# EAGLE schematic kvetinac_driver_board (EAGLE 5.11)
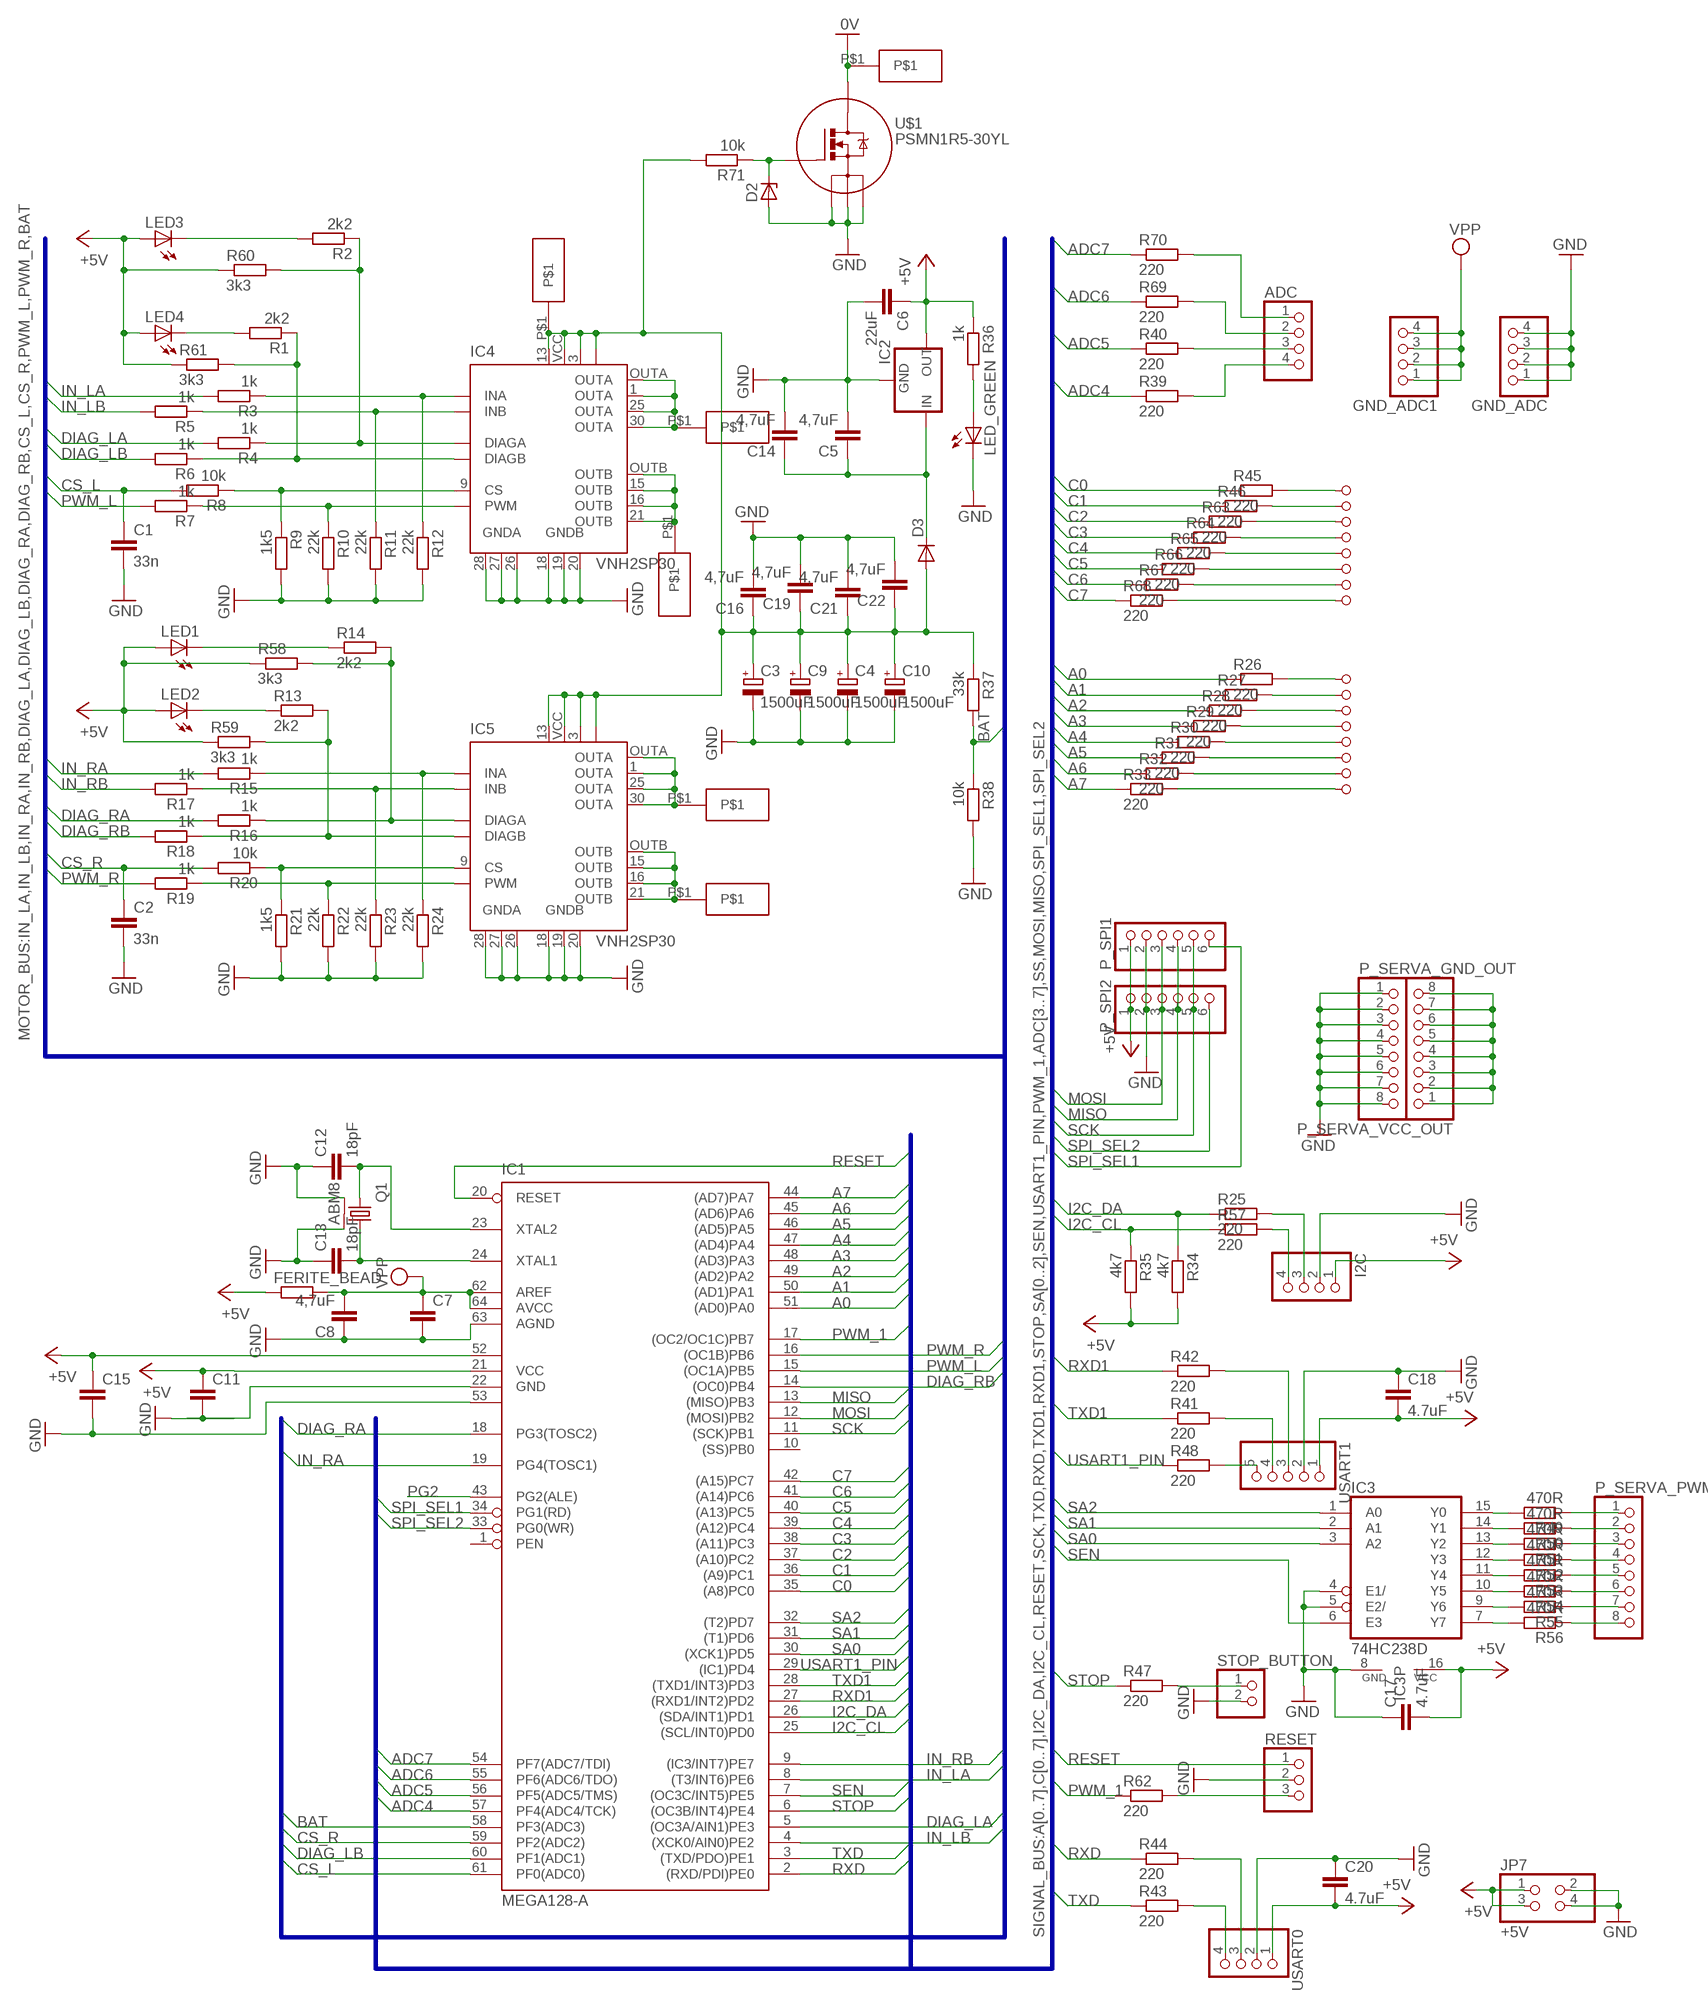
[diagram p0: schematic, sheet 1]

## Parts
0V  CABEL_SMD  [CABEL_SMD]
ADC  PINHD-1X4  [1X04]
C1  33n  C-EUC0603  [C0603]
C2  33n  C-EUC0603  [C0603]
C3  1500uF  CPOL-EUE5-10.5  [E5-10,5]
C4  1500uF  CPOL-EUE5-10.5  [E5-10,5]
C5  4,7uF  C-EUC0805  [C0805]
C6  22uF  C-EUC0805  [C0805]
C7  C-EUC0306  [C0306]
C8  4,7uF  C-EUC0805  [C0805]
C9  1500uF  CPOL-EUE5-10.5  [E5-10,5]
C10  1500uF  CPOL-EUE5-10.5  [E5-10,5]
C11  C-EUC0306  [C0306]
C12  18pF  C-EUC0603  [C0603]
C13  18pF  C-EUC0603  [C0603]
C14  4,7uF  C-EUC0805  [C0805]
C15  C-EUC0306  [C0306]
C16  4,7uF  C-EUC0805  [C0805]
C17  4.7uF  C-EUC0805  [C0805]
C18  4.7uF  C-EUC0805  [C0805]
C19  4,7uF  C-EUC0805  [C0805]
C20  4.7uF  C-EUC0805  [C0805]
C21  4,7uF  C-EUC0805  [C0805]
C22  4,7uF  C-EUC0805  [C0805]
D2  ZENER-DIODESOD80C  [SOD80C]
D3  DIODE-MINIMELF  [MINIMELF]
FERITE_BEAD  R-EU_R0603  [R0603]
GND_ADC  PINHD-1X4  [1X04]
GND_ADC1  PINHD-1X4  [1X04]
I2C  PINHD-1X4  [1X04]
IC1  MEGA128-A  [TQFP64]
IC2  78XXS  [78XXS]
IC3  74HC238D  [SO16]
IC4  VNH2SP30  [MULTIPOWERSO-30]
IC5  VNH2SP30  [MULTIPOWERSO-30]
J1  PINHD-1X1SMD2.4MM  [1X01/SMD]
J2  PINHD-1X1SMD2.4MM  [1X01/SMD]
J3  PINHD-1X1SMD2.4MM  [1X01/SMD]
J4  PINHD-1X1SMD2.4MM  [1X01/SMD]
J5  PINHD-1X1SMD2.4MM  [1X01/SMD]
J6  PINHD-1X1SMD2.4MM  [1X01/SMD]
J7  PINHD-1X1SMD2.4MM  [1X01/SMD]
J8  PINHD-1X1SMD2.4MM  [1X01/SMD]
J9  PINHD-1X1SMD2.4MM  [1X01/SMD]
J10  PINHD-1X1SMD2.4MM  [1X01/SMD]
J11  PINHD-1X1SMD2.4MM  [1X01/SMD]
J12  PINHD-1X1SMD2.4MM  [1X01/SMD]
J13  PINHD-1X1SMD2.4MM  [1X01/SMD]
J14  PINHD-1X1SMD2.4MM  [1X01/SMD]
J15  PINHD-1X1SMD2.4MM  [1X01/SMD]
J16  PINHD-1X1SMD2.4MM  [1X01/SMD]
JP7  +5V  PINHD-2X2  [2X02]
LED1  LEDCHIPLED_0805  [CHIPLED_0805]
LED2  LEDCHIPLED_0805  [CHIPLED_0805]
LED3  LEDCHIPLED_0805  [CHIPLED_0805]
LED4  LEDCHIPLED_0805  [CHIPLED_0805]
LED_GREEN  LEDCHIPLED_0805  [CHIPLED_0805]
OUTA_1  CABEL_SMD  [CABEL_SMD]
OUTA_2  CABEL_SMD  [CABEL_SMD]
OUTB_1  CABEL_SMD  [CABEL_SMD]
OUTB_2  CABEL_SMD  [CABEL_SMD]
P_SERVA_GND_OUT  PINHD-1X8  [1X08]
P_SERVA_PWM  PINHD-1X8  [1X08]
P_SERVA_VCC_OUT  PINHD-1X8  [1X08]
P_SPI1  PINHD-1X6  [1X06]
P_SPI2  PINHD-1X6  [1X06]
Q1  ABM8  [ABM8]
R1  2k2  R-EU_R0603  [R0603]
R2  2k2  R-EU_R0603  [R0603]
R3  1k  R-EU_R0603  [R0603]
R4  1k  R-EU_R0603  [R0603]
R5  1k  R-EU_R0603  [R0603]
R6  1k  R-EU_R0603  [R0603]
R7  1k  R-EU_R0603  [R0603]
R8  10k  R-EU_R0603  [R0603]
R9  1k5  R-EU_R0603  [R0603]
R10  22k  R-EU_R0603  [R0603]
R11  22k  R-EU_R0603  [R0603]
R12  22k  R-EU_R0603  [R0603]
R13  2k2  R-EU_R0603  [R0603]
R14  2k2  R-EU_R0603  [R0603]
R15  1k  R-EU_R0603  [R0603]
R16  1k  R-EU_R0603  [R0603]
R17  1k  R-EU_R0603  [R0603]
R18  1k  R-EU_R0603  [R0603]
R19  1k  R-EU_R0603  [R0603]
R20  10k  R-EU_R0603  [R0603]
R21  1k5  R-EU_R0603  [R0603]
R22  22k  R-EU_R0603  [R0603]
R23  22k  R-EU_R0603  [R0603]
R24  22k  R-EU_R0603  [R0603]
R25  220  R-EU_R0603  [R0603]
R26  220  R-EU_R0603  [R0603]
R27  220  R-EU_R0603  [R0603]
R28  220  R-EU_R0603  [R0603]
R29  220  R-EU_R0603  [R0603]
R30  220  R-EU_R0603  [R0603]
R31  220  R-EU_R0603  [R0603]
R32  220  R-EU_R0603  [R0603]
R33  220  R-EU_R0603  [R0603]
R34  4k7  R-EU_R0603  [R0603]
R35  4k7  R-EU_R0603  [R0603]
R36  1k  R-EU_R0603  [R0603]
R37  33k  R-EU_R0603  [R0603]
R38  10k  R-EU_R0603  [R0603]
R39  220  R-EU_R0603  [R0603]
R40  220  R-EU_R0603  [R0603]
R41  220  R-EU_R0603  [R0603]
R42  220  R-EU_R0603  [R0603]
R43  220  R-EU_R0603  [R0603]
R44  220  R-EU_R0603  [R0603]
R45  220  R-EU_R0603  [R0603]
R46  220  R-EU_R0603  [R0603]
R47  220  R-EU_R0603  [R0603]
R48  220  R-EU_R0603  [R0603]
R49  470R  R-EU_R0603  [R0603]
R50  470R  R-EU_R0603  [R0603]
R51  470R  R-EU_R0603  [R0603]
R52  470R  R-EU_R0603  [R0603]
R53  470R  R-EU_R0603  [R0603]
R54  470R  R-EU_R0603  [R0603]
R55  470R  R-EU_R0603  [R0603]
R56  470R  R-EU_R0603  [R0603]
R57  220  R-EU_R0603  [R0603]
R58  3k3  R-EU_R0603  [R0603]
R59  3k3  R-EU_R0603  [R0603]
R60  3k3  R-EU_R0603  [R0603]
R61  3k3  R-EU_R0603  [R0603]
R62  220  R-EU_R0603  [R0603]
R63  220  R-EU_R0603  [R0603]
R64  220  R-EU_R0603  [R0603]
R65  220  R-EU_R0603  [R0603]
R66  220  R-EU_R0603  [R0603]
R67  220  R-EU_R0603  [R0603]
R68  220  R-EU_R0603  [R0603]
R69  220  R-EU_R0603  [R0603]
R70  220  R-EU_R0603  [R0603]
R71  10k  R-EU_R0603  [R0603]
RESET  PINHD-1X3  [1X03]
STOP_BUTTON  PINHD-1X2  [1X02]
U$1  PSMN1R5-30YL  [SOT669]
USART0  PINHD-1X4  [1X04]
USART1  PINHD-1X5  [1X05]
VCC  CABEL_SMD  [CABEL_SMD]

## Nets
0V: 0V.P$1 U$1.P$5(D)
+5V: C6.1 C11.1 C15.1 C17.2 C18.2 C20.2 FERITE_BEAD.1 I2C.1 IC1.21(VCC) IC1.52(VCC1) IC2.OUT IC3.16(VCC) JP7.1 JP7.3 LED1.A LED2.A LED3.A LED4.A P_SPI1.1 P_SPI2.1 R34.2 R35.2 R36.1 R58.1 R59.1 R60.1 R61.1 USART0.1 USART1.1
A0: IC1.51((AD0)PA0) R26.1
A1: IC1.50((AD1)PA1) R27.1
A2: IC1.49((AD2)PA2) R28.1
A3: IC1.48((AD3)PA3) R29.1
A4: IC1.47((AD4)PA4) R30.1
A5: IC1.46((AD5)PA5) R31.1
A6: IC1.45((AD6)PA6) R32.1
A7: IC1.44((AD7)PA7) R33.1
ADC4: IC1.57(PF4(ADC4/TCK)) R39.1
ADC5: IC1.56(PF5(ADC5/TMS)) R40.1
ADC6: IC1.55(PF6(ADC6/TDO)) R69.1
ADC7: IC1.54(PF7(ADC7/TDI)) R70.1
BAT: IC1.58(PF3(ADC3)) R37.2 R38.1
BAZE: D2.C R71.1 U$1.P$4(G)
C0: IC1.35((A8)PC0) R45.1
C1: IC1.36((A9)PC1) R46.1
C2: IC1.37((A10)PC2) R63.1
C3: IC1.38((A11)PC3) R64.1
C4: IC1.39((A12)PC4) R65.1
C5: IC1.40((A13)PC5) R66.1
C6: IC1.41((A14)PC6) R67.1
C7: IC1.42((A15)PC7) R68.1
CS_L: C1.1 IC1.61(PF0(ADC0)) R8.2
CS_R: C2.1 IC1.59(PF2(ADC2)) R20.2
DIAG_LA: IC1.5((OC3A/AIN1)PE3) R4.2
DIAG_LB: IC1.60(PF1(ADC1)) R6.2
DIAG_RA: IC1.18(PG3(TOSC2)) R16.2
DIAG_RB: IC1.14((OC0)PB4) R18.2
GND: C1.2 C2.2 C3.- C4.- C5.2 C6.2 C7.2 C8.1 C9.- C10.- C11.2 C12.1 C13.1 C14.2 C15.2 C16.2 C17.1 C18.1 C19.2 C20.1 C21.2 C22.2 D2.A GND_ADC.1 GND_ADC.2 GND_ADC.3 GND_ADC.4 I2C.2 IC1.22(GND) IC1.53(GND1) IC1.63(AGND) IC2.GND IC3.4(E1/) IC3.5(E2/) IC3.8(GND) IC4.18(GNDB) IC4.19(GNDB) IC4.20(GNDB) IC4.26(GNDA) IC4.27(GNDA) IC4.28(GNDA) IC5.18(GNDB) IC5.19(GNDB) IC5.20(GNDB) IC5.26(GNDA) IC5.27(GNDA) IC5.28(GNDA) JP7.2 JP7.4 LED_GREEN.C P_SERVA_GND_OUT.1 P_SERVA_GND_OUT.2 P_SERVA_GND_OUT.3 P_SERVA_GND_OUT.4 P_SERVA_GND_OUT.5 P_SERVA_GND_OUT.6 P_SERVA_GND_OUT.7 P_SERVA_GND_OUT.8 P_SPI1.2 P_SPI2.2 Q1.GND$1 Q1.GND$2 R9.2 R10.2 R11.2 R12.2 R21.2 R22.2 R23.2 R24.2 R38.2 RESET.2 STOP_BUTTON.2 U$1.P$1(S) U$1.P$2(S) U$1.P$3(S) USART0.2 USART1.2
I2C_CL: IC1.25((SCL/INT0)PD0) R35.1 R57.1
I2C_DA: IC1.26((SDA/INT1)PD1) R25.1 R34.1
IN_LA: IC1.8((T3/INT6)PE6) R3.2
IN_LB: IC1.4((XCK0/AIN0)PE2) R5.2
IN_RA: IC1.19(PG4(TOSC1)) R15.2
IN_RB: IC1.9((IC3/INT7)PE7) R17.2
MISO: IC1.13((MISO)PB3) P_SPI1.4 P_SPI2.4
MOSI: IC1.12((MOSI)PB2) P_SPI1.3 P_SPI2.3
N$1: IC4.5(INA) R3.1 R12.1
N$2: IC5.10(DIAGB) R13.2 R18.1 R59.2
N$3: IC4.11(INB) R5.1 R11.1
N$4: IC5.6(DIAGA) R14.2 R16.1 R58.2
N$5: IC4.8(PWM) R7.1 R10.1
N$6: IC4.9(CS) R8.1 R9.1
N$7: IC4.6(DIAGA) R2.1 R4.1 R60.2
N$8: C12.2 IC1.23(XTAL2) Q1.Q$1
N$9: C13.2 IC1.24(XTAL1) Q1.Q$2
N$11: IC5.5(INA) R15.1 R24.1
N$12: IC4.10(DIAGB) R1.1 R6.1 R61.2
N$13: IC5.11(INB) R17.1 R23.1
N$14: LED1.C R14.1
N$15: IC5.8(PWM) R19.1 R22.1
N$16: IC5.9(CS) R20.1 R21.1
N$19: ADC.3 R40.2
N$20: LED2.C R13.1
N$21: LED_GREEN.A R36.2
N$22: J9.1 R26.2
N$23: J10.1 R27.2
N$24: J11.1 R28.2
N$25: J12.1 R29.2
N$26: J13.1 R30.2
N$27: J14.1 R31.2
N$28: J15.1 R32.2
N$29: J16.1 R33.2
N$30: R41.2 USART1.4
N$31: R42.2 USART1.3
N$32: R43.2 USART0.4
N$33: R44.2 USART0.3
N$34: ADC.4 R39.2
N$35: R48.2 USART1.5
N$36: R47.2 STOP_BUTTON.1
N$37: LED3.C R2.2
N$38: LED4.C R1.2
N$39: IC3.15(Y0) R49.2
N$41: IC3.14(Y1) R50.2
N$42: IC3.13(Y2) R51.2
N$43: IC3.12(Y3) R52.2
N$44: IC3.11(Y4) R53.2
N$45: IC3.10(Y5) R54.2
N$46: IC3.9(Y6) R55.2
N$47: IC3.7(Y7) R56.2
N$48: P_SERVA_PWM.8 R56.1
N$49: P_SERVA_PWM.7 R55.1
N$50: P_SERVA_PWM.6 R54.1
N$51: P_SERVA_PWM.5 R53.1
N$52: P_SERVA_PWM.4 R52.1
N$53: P_SERVA_PWM.3 R51.1
N$54: P_SERVA_PWM.2 R50.1
N$55: P_SERVA_PWM.1 R49.1
N$56: R62.2 RESET.3
N$57: I2C.3 R25.2
N$58: ADC.2 R69.2
N$59: ADC.1 R70.2
N$60: I2C.4 R57.2
N$62: J1.1 R45.2
N$67: J2.1 R46.2
N$68: J3.1 R63.2
N$69: J4.1 R64.2
N$70: J5.1 R65.2
N$71: J6.1 R66.2
N$72: J7.1 R67.2
N$73: J8.1 R68.2
N$88: C5.1 C14.1 D3.C IC2.IN
OUTA_1: IC4.1(OUTA) IC4.25(OUTA) IC4.30(OUTA) IC4.OUTA OUTA_1.P$1
OUTA_2: IC5.1(OUTA) IC5.25(OUTA) IC5.30(OUTA) IC5.OUTA OUTA_2.P$1
OUTB_1: IC4.15(OUTB) IC4.16(OUTB) IC4.21(OUTB) IC4.OUTB OUTB_1.P$1
OUTB_2: IC5.15(OUTB) IC5.16(OUTB) IC5.21(OUTB) IC5.OUTB OUTB_2.P$1
PG2: IC1.43(PG2(ALE))
PWM_1: IC1.17((OC2/OC1C)PB7) R62.1
PWM_L: IC1.15((OC1A)PB5) R7.2
PWM_R: IC1.16((OC1B)PB6) R19.2
RESET: IC1.20(RESET) RESET.1
RXD: IC1.2((RXD/PDI)PE0) R43.1
RXD1: IC1.27((RXD1/INT2)PD2) R42.1
SA0: IC1.30((XCK1)PD5) IC3.3(A2)
SA1: IC1.31((T1)PD6) IC3.2(A1)
SA2: IC1.32((T2)PD7) IC3.1(A0)
SCK: IC1.11((SCK)PB1) P_SPI1.5 P_SPI2.5
SEN: IC1.7((OC3C/INT5)PE5) IC3.6(E3)
SERVA_VCC: P_SERVA_VCC_OUT.1 P_SERVA_VCC_OUT.2 P_SERVA_VCC_OUT.3 P_SERVA_VCC_OUT.4 P_SERVA_VCC_OUT.5 P_SERVA_VCC_OUT.6 P_SERVA_VCC_OUT.7 P_SERVA_VCC_OUT.8
SPI_SEL1: IC1.34(PG1(RD)) P_SPI1.6
SPI_SEL2: IC1.33(PG0(WR)) P_SPI2.6
STOP: IC1.6((OC3B/INT4)PE4) R47.1
TXD: IC1.3((TXD/PDO)PE1) R44.1
TXD1: IC1.28((TXD1/INT3)PD3) R41.1
USART1_PIN: IC1.29((IC1)PD4) R48.1
VCC: C3.+ C4.+ C9.+ C10.+ C16.1 C19.1 C21.1 C22.1 D3.A IC4.3(VCC) IC4.13(VCC) IC4.23(VCC) IC4.VCC IC5.3(VCC) IC5.13(VCC) IC5.23(VCC) IC5.VCC R37.1 R71.2 VCC.P$1
VPP: C7.1 C8.2 FERITE_BEAD.2 GND_ADC1.1 GND_ADC1.2 GND_ADC1.3 GND_ADC1.4 IC1.62(AREF) IC1.64(AVCC)
Unconnected: IC1.1(PEN) IC1.10((SS)PB0)

## Buses
MOTOR_BUS:IN_LA,IN_LB,IN_RA,IN_RB,DIAG_LA,DIAG_LB,DIAG_RA,DIAG_RB,CS_L,CS_R,PWM_L,PWM_R,BAT
SIGNAL_BUS:A[0..7],C[0..7],I2C_DA,I2C_CL,RESET,SCK,TXD,RXD,TXD1,RXD1,STOP,SA[0..2],SEN,USART1_PIN,PWM_1,ADC[3..7],SS,MOSI,MISO,SPI_SEL1,SPI_SEL2

## Library data of the parts
0V OUTA_1 OUTA_2 OUTB_1 OUTB_2 VCC = cabel_smd:CABEL_SMD
ADC GND_ADC GND_ADC1 I2C USART0 = pinhead:PINHD-1X4: PIN HEADER
C1 C2 C5 C6 C8 C12-C14 C16-C22 = rcl:C-EU: CAPACITOR, European symbol
C3 C4 C9 C10 = rcl:CPOL-EU: POLARIZED CAPACITOR, European symbol
C7 C11 C15 = rcl_upravena:C-EU: CAPACITOR, European symbol
D2 = diode:ZENER-DIODE: Z-Diode
D3 = diode:DIODE-: DIODE
FERITE_BEAD R1-R71 = rcl:R-EU_: RESISTOR, European symbol
IC1 = avr:MEGA128: MICROCONTROLLER 128 Kbytes FLASH 4 Kbytes SRAM 4 Kbytes EEPROM DUAL USART 8-channel 10 bit ADC
IC2 = v-reg:78XXS: VOLTAGE REGULATOR
IC3 = 74:74*238: 3-line to 8-line DECODER/DEMULTIPLEXER
IC4 IC5 = vacha:VNH2SP30: FULLY INTEGRATED H-BRIDGE MOTOR DRIVER Source: http://pdf1.alldatasheet.com/datasheet-pdf/view/84563/STMICROELECTRONICS/VNH3SP30.html
J1-J16 = pinhead_smd:PINHD-1X1
JP7 = pinhead:PINHD-2X2: PIN HEADER
LED1-LED4 LED_GREEN = led:LED: LED OSRAM: - CHIPLED LG R971, LG N971, LY N971, LG Q971, LY Q971, LO R971, LY R971 LH N974, LH R974 LS Q976, LO Q976, LY Q976 LO Q996 - Hyper CHIPLED LW Q18S LB Q993, LB Q99A, LB R99A - SideLED LS A670, LO A670, LY A670, LG A670, LP A670 LB A673, LV A673, LT A673, LW A673 LH A674 LY A675 LS A676, LA A676, LO A676, LY A676, LW A676 LS A679, LY A679, LG A679 - Hyper Micro SIDELED® LS Y876, LA Y876, LO Y876, LY Y876 LT Y87S - SmartLED LW L88C, LW L88S LB L89C, LB L89S, LG L890 LS L89K, LO L89K, LY L89K LS L896, LA L896, LO L896, LY L896 - TOPLED LS T670, LO T670, LY T670, LG T670, LP T670 LSG T670, LSP T670, LSY T670, LOP T670, LYG T670 LG T671, LOG T671, LSG T671 LB T673, LV T673, LT T673, LW T673 LH T674 LS T676, LA T676, LO T676, LY T676, LB T676, LH T676, LSB T676, LW T676 LB T67C, LV T67C, LT T67C, LS T67K, LO T67K, LY T67K, LW E67C LS E67B, LA E67B, LO E67B, LY E67B, LB E67C, LV E67C, LT E67C LW T67C LS T679, LY T679, LG T679 LS T770, LO T770, LY T770, LG T770, LP T770 LB T773, LV T773, LT T773, LW T773 LH T774 LS E675, LA E675, LY E675, LS T675 LS T776, LA T776, LO T776, LY T776, LB T776 LHGB T686 LT T68C, LB T68C - Hyper Mini TOPLED® LB M676 - Mini TOPLED Santana® LG M470 LS M47K, LO M47K, LY M47K Source: http://www.osram.convergy.de LUXEON: - LUMILED® LXK2-PW12-R00, LXK2-PW12-S00, LXK2-PW14-U00, LXK2-PW14-V00 LXK2-PM12-R00, LXK2-PM12-S00, LXK2-PM14-U00 LXK2-PE12-Q00, LXK2-PE12-R00, LXK2-PE12-S00, LXK2-PE14-T00, LXK2-PE14-U00 LXK2-PB12-K00, LXK2-PB12-L00, LXK2-PB12-M00, LXK2-PB14-N00, LXK2-PB14-P00, LXK2-PB14-Q00 LXK2-PR12-L00, LXK2-PR12-M00, LXK2-PR14-Q00, LXK2-PR14-R00 LXK2-PD12-Q00, LXK2-PD12-R00, LXK2-PD12-S00 LXK2-PH12-R00, LXK2-PH12-S00 LXK2-PL12-P00, LXK2-PL12-Q00, LXK2-PL12-R00 Source: www.luxeon.com KINGBRIGHT: KA-3528ASYC Source: www.kingbright.com
P_SERVA_GND_OUT P_SERVA_PWM P_SERVA_VCC_OUT = pinhead:PINHD-1X8: PIN HEADER
P_SPI1 P_SPI2 = pinhead:PINHD-1X6: PIN HEADER
Q1 = crystal:ABM8
RESET = pinhead:PINHD-1X3: PIN HEADER
STOP_BUTTON = pinhead:PINHD-1X2: PIN HEADER
U$1 = psmn1r5-30yl:PSMN1R5-30YL: N-channel 30V 1.5 mOhm logic level MOSFET
USART1 = pinhead:PINHD-1X5: PIN HEADER